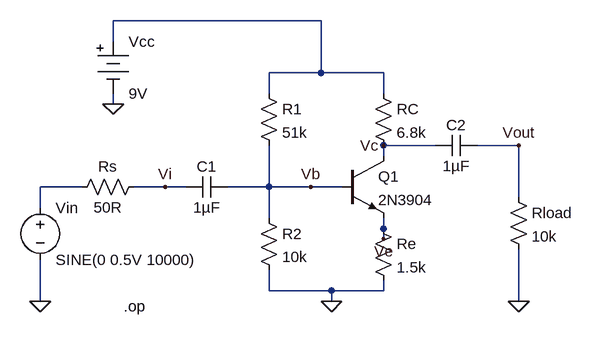
[diagram p0: schematic BJTamp.asc]
BJTamp.asc, the LTspice schematic file:
Version 4
SHEET 1 880 680
WIRE 176 -48 -144 -48
WIRE -144 -16 -144 -48
WIRE 176 32 176 -48
WIRE 176 32 96 32
WIRE 272 32 176 32
WIRE 96 64 96 32
WIRE 272 64 272 32
WIRE -144 80 -144 64
WIRE 352 144 272 144
WIRE 480 144 416 144
WIRE 272 160 272 144
WIRE -192 208 -256 208
WIRE -64 208 -112 208
WIRE -32 208 -64 208
WIRE 96 208 96 144
WIRE 96 208 32 208
WIRE 160 208 96 208
WIRE 208 208 160 208
WIRE 480 224 480 144
WIRE -256 240 -256 208
WIRE 96 256 96 208
WIRE 272 272 272 256
WIRE 272 288 272 272
WIRE 96 368 96 336
WIRE 192 368 96 368
WIRE 272 368 272 352
WIRE 272 368 192 368
WIRE -256 384 -256 320
WIRE 192 384 192 368
WIRE 480 384 480 304
FLAG 192 384 0
FLAG 480 384 0
FLAG -144 80 0
FLAG 160 208 Vb
FLAG 272 288 Ve
FLAG 480 144 Vout
FLAG 272 144 Vc
FLAG -256 384 0
FLAG -64 208 Vi
SYMBOL res 80 48 R0
SYMATTR InstName R1
SYMATTR Value 51k
SYMBOL res 80 240 R0
SYMATTR InstName R2
SYMATTR Value 10k
SYMBOL res 464 208 R0
SYMATTR InstName Rload
SYMATTR Value 10k
SYMBOL res 256 48 R0
SYMATTR InstName RC
SYMATTR Value 6.8k
SYMBOL npn 208 160 R0
SYMATTR InstName Q1
SYMATTR Value 2N3904
SYMBOL cap -32 224 R270
WINDOW 0 32 32 VTop 2
WINDOW 3 0 32 VBottom 2
SYMATTR InstName C1
SYMATTR Value 1µF
SYMBOL cap 352 160 R270
WINDOW 0 32 32 VTop 2
WINDOW 3 0 32 VBottom 2
SYMATTR InstName C2
SYMATTR Value 1µF
SYMBOL Misc\\battery -144 -32 R0
SYMATTR InstName Vcc
SYMATTR Value 9V
SYMBOL res 256 256 R0
SYMATTR InstName Re
SYMATTR Value 1.5k
SYMBOL voltage -256 224 R0
WINDOW 123 0 0 Left 2
WINDOW 39 0 0 Left 2
SYMATTR InstName Vin
SYMATTR Value SINE(0 0.5V 10000)
SYMBOL res -208 224 R270
WINDOW 0 32 56 VTop 2
WINDOW 3 0 56 VBottom 2
SYMATTR InstName Rs
SYMATTR Value 50R
TEXT -128 392 Left 2 !.op

The netlist it stands for:
* BJTamp.asc
R1 N001 Vb 51k
R2 Vb 0 10k
Rload Vout 0 10k
RC N001 Vc 6.8k
Q1 Vc Vb Ve 0 2N3904
C1 Vi Vb 1µF
C2 Vc Vout 1µF
Vcc N001 0 9V
Re Ve 0 1.5k
Vin N002 0 SINE(0 0.5V 10000)
Rs N002 Vi 50R
.model NPN NPN
.model PNP PNP
.lib standard.bjt
.op
.backanno
.end